# EAGLE board Central Board (EAGLE 8.4.1)
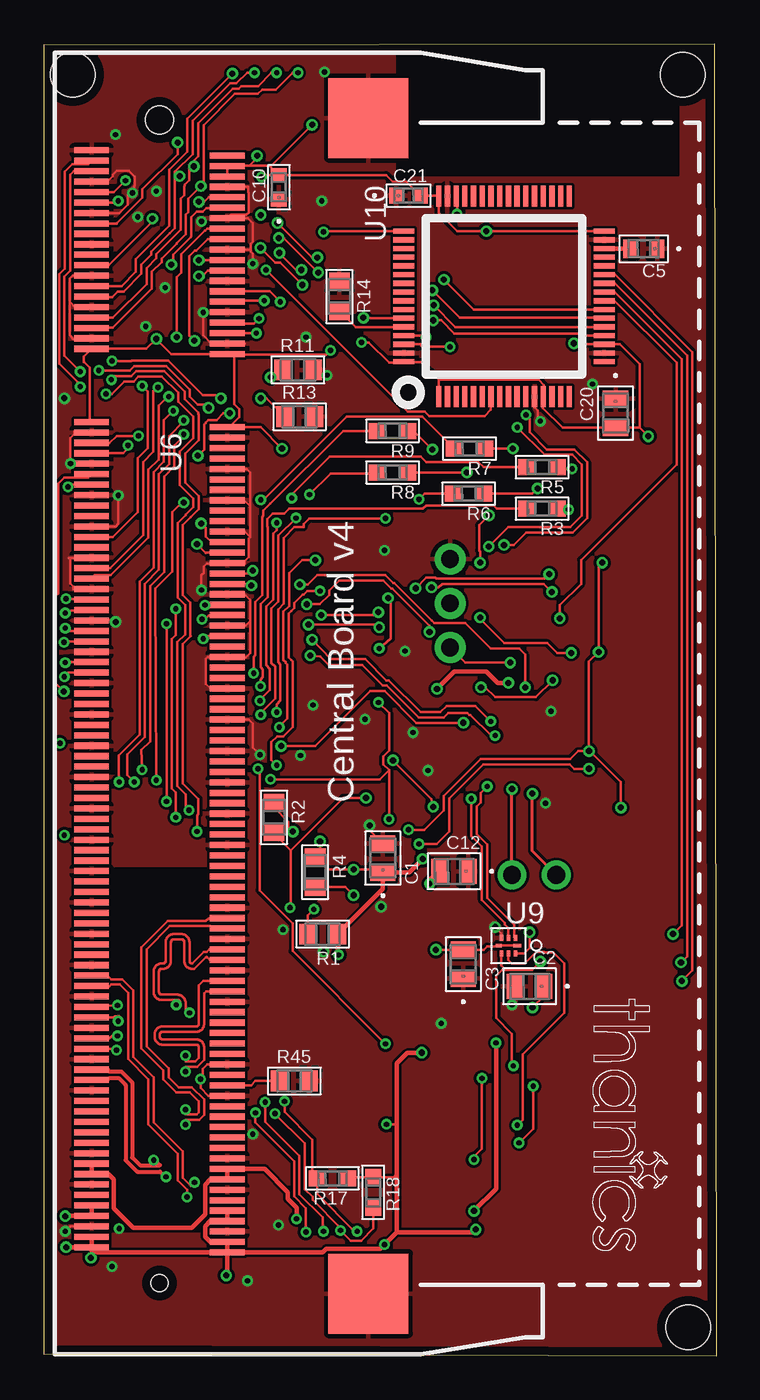
[diagram p3: board, top side]
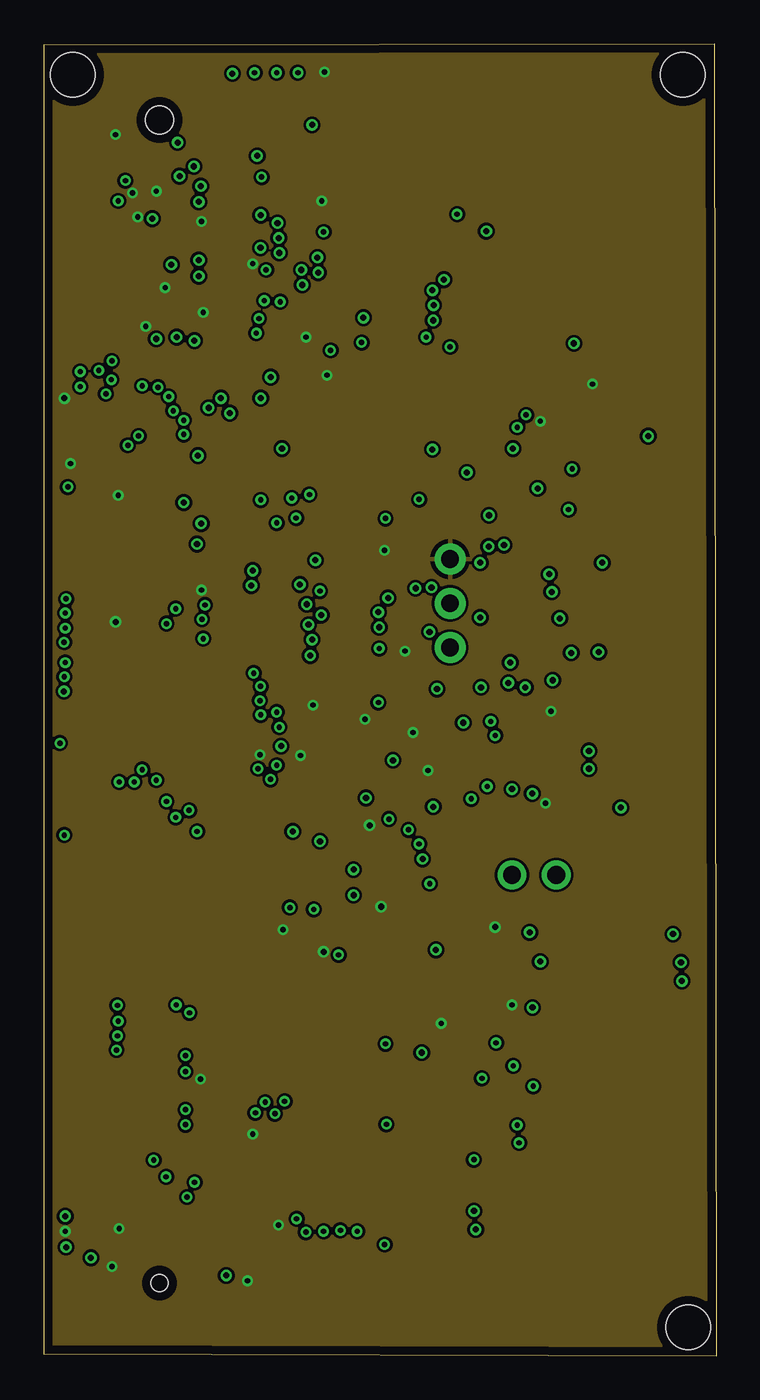
[diagram p4: board, inner layer Route2]
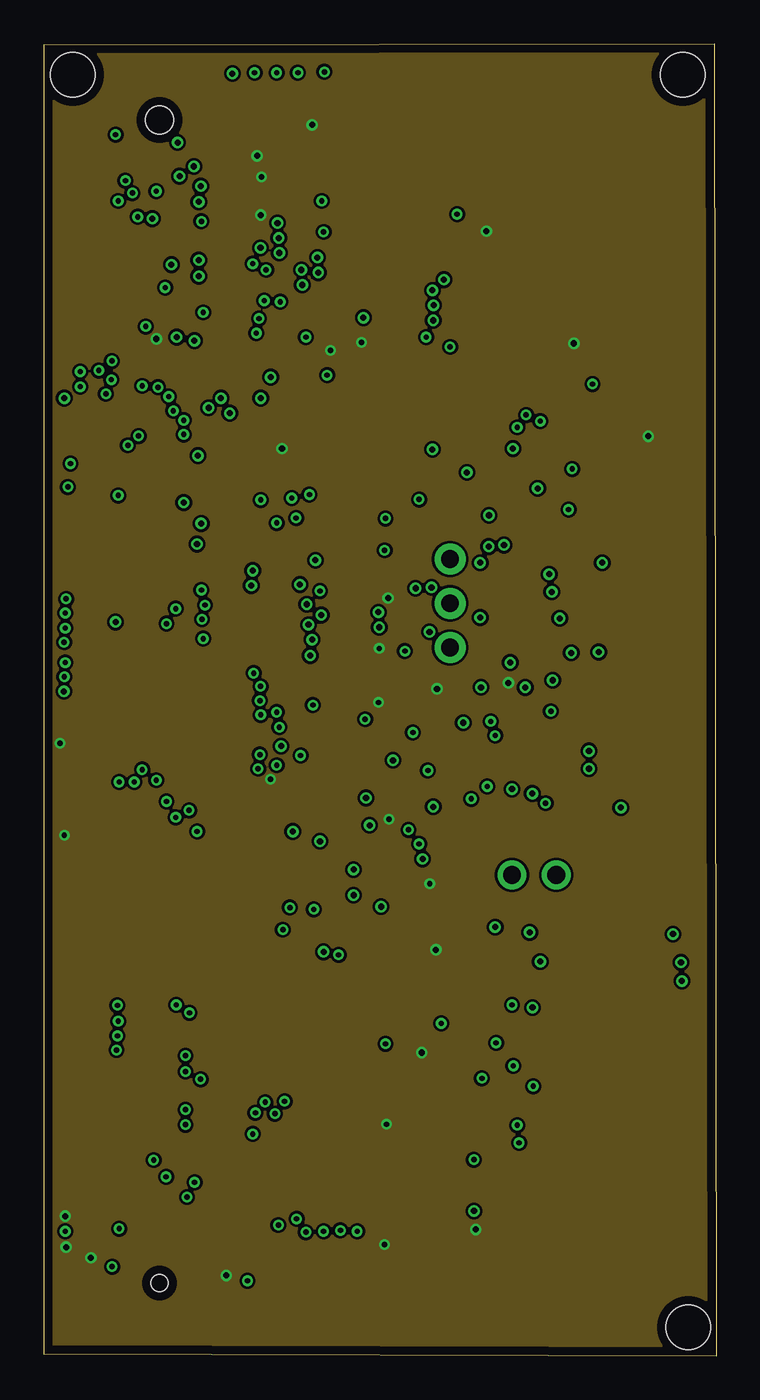
[diagram p5: board, inner layer Route15]
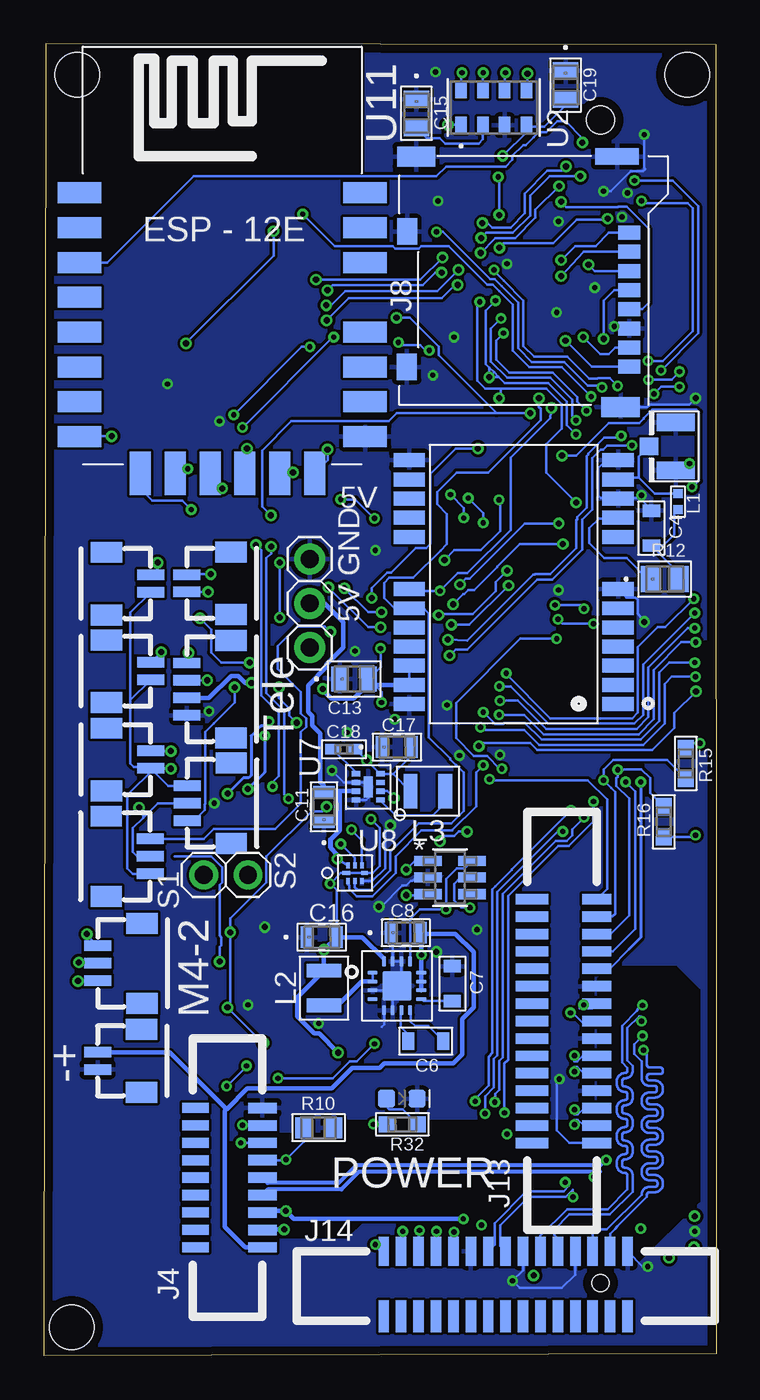
[diagram p6: board, bottom side, seen from below]

Size 38.63 x 75.39 mm. Coordinates in mm from the lower left corner, seen from the top.
Outline: 0,0.13 38.63,0 38.51,75.39 0.03,75.31 0,0.13
Copper layers (1*2*15*16): Top 0.035mm / dielectric 0.2mm / Route2 0.0175mm / dielectric 1.2mm / Route15 0.0175mm / dielectric 0.2mm / Bottom 0.035mm
Design rules "Elecrow_4-layer_PCB_eagle_rule *": minimum track width 6mil, minimum drill 12mil, track to track 6mil, track to pad 6mil, pad to pad 6mil, via to via 8mil, smd to smd 0mil, copper to edge 20mil, drill to drill 10mil, minimum pad ring 6mil, minimum via ring 6mil, stop-mask expansion 0mil, vias tented up to drill 100mil, thermal gap 10mil
Holes 2.54 mm at 37.01,1.65 1.68,73.58 36.7,73.58

## Footprints (pad centres in the part's own frame; a part is rotated, then mirrored left to right if it is on the bottom)
0805 = smd 0.965 x 1.448: 1 -0.826,0; 2 0.826,0
0603_CAPACITOR = smd 0.701 x 1.001: 1 -1.001,0; 2 1.001,0
0603-M = smd 0.813 x 1.067: 1 -0.775,0; 2 0.775,0
G-21 = smd 0.711 x 1.245: 1 -0.851,0; 2 0.851,0
G-188-M = smd 0.813 x 0.914: 1 -0.699,0; 2 0.699,0
YAG_CC0805 = smd 0.965 x 1.448: 1 -0.826,0; 2 0.826,0
CC0402N-M = smd 0.864 x 0.61: 1 -0.635,0; 2 0.635,0
LED-0603 = smd 1 x 1: A -0.877,0; C 0.877,0
JST_SH_2POS = smd 0.6 x 1.55: 1 -1.5,0; 2 -0.5,0 | smd 1.2 x 1.8: P$5 -2.8,2.525; P$6 0.8,2.525
JST_SH_4POS = smd 0.6 x 1.55: 1 -1.5,0; 2 -0.5,0; 3 0.5,0; 4 1.5,0 | smd 1.2 x 1.8: P$5 -2.8,2.525; P$6 2.8,2.525
9POS_FFC_CONNECTOR = smd 0.6 x 1.65: 1 -7.27,-2; 2 -6.27,-2; 3 -5.27,-2; 4 -4.27,-2; 5 -3.27,-2; 6 -2.27,-2; 7 -1.27,-2; 8 -0.27,-2; 9 0.73,-2 | smd 0.584 x 1.524: P$16 -7.27,1.852; P$17 -6.27,1.852; P$18 -5.27,1.852; P$19 -4.27,1.852; P$20 -3.27,1.852; P$21 -2.27,1.852; P$22 -1.27,1.852; P$23 -0.27,1.852; P$24 0.73,1.852
U.FL = smd 2.2 x 1: P$1 0,1.375; P$2 0,-1.375 | smd 1.05 x 1: P$3 1.525,0
MICROSD = smd 0.8 x 1.24: 1 -4.4,0; 2 -3.3,0; 3 -2.2,0; 4 -1.1,0; 5 0,0; 6 1.1,0; 7 2.2,0; 8 3.3,0 | smd 0.95 x 2.5: 9 -8.775,-0.7 | smd 1.15 x 2.2: 10 5.615,-0.5; 11 -8.775,-12.23 | smd 1.5 x 1.15: 12 -4.47,-12.755; 13 3.31,-12.775
JST_SH_3POS = smd 0.6 x 1.55: 1 -1.61,-0.08; 2 -0.61,-0.08; 3 0.39,-0.08 | smd 1.2 x 1.8: P$5 -2.91,2.445; P$6 1.69,2.445
15POS_FFC_CONNECTOR = smd 0.6 x 1.65: 1 -6,-2; 2 -5,-2; 3 -4,-2; 4 -3,-2; 5 -2,-2; 6 -1,-2; 7 0,-2; 8 1,-2; 9 2,-2; 10 3,-2; 11 4,-2; 12 5,-2; 13 6,-2; 14 7,-2; 15 8,-2 | smd 0.6 x 1.85: P$16 -6,1.725; P$17 -5,1.725; P$18 -4,1.725; P$19 -3,1.725; P$20 -2,1.725; P$21 -1,1.725; P$22 0,1.725; P$23 1,1.725; P$24 2,1.725; P$25 3,1.725; P$26 4,1.725; P$27 5,1.725; P$28 6,1.725; P$29 7,1.725; P$30 8,1.725
1X02 = drill 1.016 pad 1.651: 1 -1.27,0; 2 1.27,0
1X03 = drill 1.016 pad 1.778: 1 -2.54,0; 2 0,0; 3 2.54,0
0402_INDUCTOR = smd 0.525 x 0.55: P$1 -0.463,0; P$2 0.463,0
1008_INDUCTOR = smd 0.8 x 2: P$1 -1,0; P$2 1,0
RC0805N = smd 1.006 x 1.2: 1 -0.853,0; 2 0.853,0
RC0603N-M = smd 0.965 x 0.914: 1 -0.876,0; 2 0.876,0
STA_RNCP0805-M = smd 1.118 x 1.499: 1 -0.826,0; 2 0.826,0
LGA8-M = smd 0.94 x 0.66: 1 -1.003,1.875; 2 -1.003,0.625; 3 -1.003,-0.625; 4 -1.003,-1.875; 5 1.003,-1.875; 6 1.003,-0.625; 7 1.003,0.625; 8 1.003,1.875
MF06A-M = smd 1.575 x 0.584: 1 -1.27,0.953; 2 -1.27,0; 3 -1.27,-0.953; 4 1.27,-0.953; 5 1.27,0; 6 1.27,0.953
NEO-M8 = smd 1.8 x 0.8: 1 6.4,-7.4; 2 6.4,-6.3; 3 6.4,-5.2; 4 6.4,-4.1; 5 6.4,-3; 6 6.4,-1.9; 7 6.4,-0.8; 8 6.4,2.2; 9 6.4,3.3; 10 6.4,4.4; 11 6.4,5.5; 12 6.4,6.6; 13 -5.6,6.6; 14 -5.6,5.5; 15 -5.6,4.4; 16 -5.6,3.3; 17 -5.6,2.2; 18 -5.6,-0.8; 19 -5.6,-1.9; 20 -5.6,-3; 21 -5.6,-4.1; 22 -5.6,-5.2; 23 -5.6,-6.3; 24 -5.6,-7.4
VQFN16 = smd 0.6 x 0.24: 1 -1.4,0.75; 2 -1.4,0.25; 3 -1.4,-0.25; 4 -1.4,-0.75; 9 1.4,-0.75; 10 1.4,-0.25; 11 1.4,0.25; 12 1.4,0.75 | smd 0.24 x 0.6: 5 -0.75,-1.4; 6 -0.25,-1.4; 7 0.25,-1.4; 8 0.75,-1.4; 13 0.75,1.4; 14 0.25,1.4; 15 -0.25,1.4; 16 -0.75,1.4 | smd 1.68 x 1.68: 17 0,0
SO-DIMM = smd 0.35 x 2: 1 -26.4,-3.9; 2 -26.1,3.9; 3 -25.8,-3.9; 4 -25.5,3.9; 5 -25.2,-3.9; 6 -24.9,3.9; 7 -24.6,-3.9; 8 -24.3,3.9; 9 -24,-3.9; 10 -23.7,3.9; 11 -23.4,-3.9; 12 -23.1,3.9; 13 -22.8,-3.9; 14 -22.5,3.9; 15 -22.2,-3.9; 16 -21.9,3.9; 17 -21.6,-3.9; 18 -21.3,3.9; 19 -21,-3.9; 20 -20.7,3.9; 21 -20.4,-3.9; 22 -20.1,3.9; 23 -19.8,-3.9; 24 -19.5,3.9; 25 -19.2,-3.9; 26 -18.9,3.9; 27 -18.6,-3.9; 28 -18.3,3.9; 29 -18,-3.9; 30 -17.7,3.9; 31 -17.4,-3.9; 32 -17.1,3.9; 33 -16.8,-3.9; 34 -16.5,3.9; 35 -16.2,-3.9; 36 -15.9,3.9; 37 -15.6,-3.9; 38 -15.3,3.9; 39 -15,-3.9; 40 -14.7,3.9; 41 -10.8,-3.9; 42 -10.5,3.9; 43 -10.2,-3.9; 44 -9.9,3.9; 45 -9.6,-3.9; 46 -9.3,3.9; 47 -9,-3.9; 48 -8.7,3.9; 49 -8.4,-3.9; 50 -8.1,3.9; 51 -7.8,-3.9; 52 -7.5,3.9; 53 -7.2,-3.9; 54 -6.9,3.9; 55 -6.6,-3.9; 56 -6.3,3.9; 57 -6,-3.9; 58 -5.7,3.9; 59 -5.4,-3.9; 60 -5.1,3.9; 61 -4.8,-3.9; 62 -4.5,3.9; 63 -4.2,-3.9; 64 -3.9,3.9; 65 -3.6,-3.9; 66 -3.3,3.9; 67 -3,-3.9; 68 -2.7,3.9; 69 -2.4,-3.9; 70 -2.1,3.9; 71 -1.8,-3.9; 72 -1.5,3.9; 73 -1.2,-3.9; 74 -0.9,3.9; 75 -0.6,-3.9; 76 -0.3,3.9; 77 0,-3.9; 78 0.3,3.9; 79 0.6,-3.9; 80 0.9,3.9; 81 1.2,-3.9; 82 1.5,3.9; 83 1.8,-3.9; 84 2.1,3.9; 85 2.4,-3.9; 86 2.7,3.9; 87 3,-3.9; 88 3.3,3.9; 89 3.6,-3.9; 90 3.9,3.9; 91 4.2,-3.9; 92 4.5,3.9; 93 4.8,-3.9; 94 5.1,3.9; 95 5.4,-3.9; 96 5.7,3.9; 97 6,-3.9; 98 6.3,3.9; 99 6.6,-3.9; 100 6.9,3.9; 101 7.2,-3.9; 102 7.5,3.9; 103 7.8,-3.9; 104 8.1,3.9; 105 8.4,-3.9; 106 8.7,3.9; 107 9,-3.9; 108 9.3,3.9; 109 9.6,-3.9; 110 9.9,3.9; 111 10.2,-3.9; 112 10.5,3.9; 113 10.8,-3.9; 114 11.1,3.9; 115 11.4,-3.9; 116 11.7,3.9; 117 12,-3.9; 118 12.3,3.9; 119 12.6,-3.9; 120 12.9,3.9; 121 13.2,-3.9; 122 13.5,3.9; 123 13.8,-3.9; 124 14.1,3.9; 125 14.4,-3.9; 126 14.7,3.9; 127 15,-3.9; 128 15.3,3.9; 129 15.6,-3.9; 130 15.9,3.9; 131 16.2,-3.9; 132 16.5,3.9; 133 16.8,-3.9; 134 17.1,3.9; 135 17.4,-3.9; 136 17.7,3.9; 137 18,-3.9; 138 18.3,3.9; 139 18.6,-3.9; 140 18.9,3.9; 141 19.2,-3.9; 142 19.5,3.9; 143 19.8,-3.9; 144 20.1,3.9; 145 20.4,-3.9; 146 20.7,3.9; 147 21,-3.9; 148 21.3,3.9; 149 21.6,-3.9; 150 21.9,3.9; 151 22.2,-3.9; 152 22.5,3.9; 153 22.8,-3.9; 154 23.1,3.9; 155 23.4,-3.9; 156 23.7,3.9; 157 24,-3.9; 158 24.3,3.9; 159 24.6,-3.9; 160 24.9,3.9; 161 25.2,-3.9; 162 25.5,3.9; 163 25.8,-3.9; 164 26.1,3.9; 165 26.4,-3.9; 166 26.7,3.9; 167 27,-3.9; 168 27.3,3.9; 169 27.6,-3.9; 170 27.9,3.9; 171 28.2,-3.9; 172 28.5,3.9; 173 28.8,-3.9; 174 29.1,3.9; 175 29.4,-3.9; 176 29.7,3.9; 177 30,-3.9; 178 30.3,3.9; 179 30.6,-3.9; 180 30.9,3.9; 181 31.2,-3.9; 182 31.5,3.9; 183 31.8,-3.9; 184 32.1,3.9; 185 32.4,-3.9; 186 32.7,3.9; 187 33,-3.9; 188 33.3,3.9; 189 33.6,-3.9; 190 33.9,3.9; 191 34.2,-3.9; 192 34.5,3.9; 193 34.8,-3.9; 194 35.1,3.9; 195 35.4,-3.9; 196 35.7,3.9; 197 36,-3.9; 198 36.3,3.9; 199 36.6,-3.9; 200 36.9,3.9 | smd 4.6 x 4.6: G1 -28.254,12; G2 39.27,12 | hole 1.6: -28.15,0 | hole 0.965: 38.65,0
MLF(ML)_8PIN = smd 0.5 x 0.3: 1 -0.7,0.75; 2 -0.7,0.25; 3 -0.7,-0.25; 4 -0.7,-0.75; 5 0.7,-0.75; 6 0.7,-0.25; 7 0.7,0.25; 8 0.7,0.75 | smd 0.5 x 1.2: EP 0,0
8-UMLP = smd 0.45 x 0.22: 1 -0.5,0 | smd 0.22 x 0.35: 2 -0.4,-0.45; 3 0,-0.45; 4 0.4,-0.45; 6 0.4,0.45; 7 0,0.45; 8 -0.4,0.45 | smd 0.35 x 0.22: 5 0.55,0
LQFP64 = smd 1.2 x 0.3: 1 -5.75,3.75; 2 -5.75,3.25; 3 -5.75,2.75; 4 -5.75,2.25; 5 -5.75,1.75; 6 -5.75,1.25; 7 -5.75,0.75; 8 -5.75,0.25; 9 -5.75,-0.25; 10 -5.75,-0.75; 11 -5.75,-1.25; 12 -5.75,-1.75; 13 -5.75,-2.25; 14 -5.75,-2.75; 15 -5.75,-3.25; 16 -5.75,-3.75; 33 5.75,-3.75; 34 5.75,-3.25; 35 5.75,-2.75; 36 5.75,-2.25; 37 5.75,-1.75; 38 5.75,-1.25; 39 5.75,-0.75; 40 5.75,-0.25; 41 5.75,0.25; 42 5.75,0.75; 43 5.75,1.25; 44 5.75,1.75; 45 5.75,2.25; 46 5.75,2.75; 47 5.75,3.25; 48 5.75,3.75 | smd 0.3 x 1.2: 17 -3.75,-5.75; 18 -3.25,-5.75; 19 -2.75,-5.75; 20 -2.25,-5.75; 21 -1.75,-5.75; 22 -1.25,-5.75; 23 -0.75,-5.75; 24 -0.25,-5.75; 25 0.25,-5.75; 26 0.75,-5.75; 27 1.25,-5.75; 28 1.75,-5.75; 29 2.25,-5.75; 30 2.75,-5.75; 31 3.25,-5.75; 32 3.75,-5.75; 49 3.75,5.75; 50 3.25,5.75; 51 2.75,5.75; 52 2.25,5.75; 53 1.75,5.75; 54 1.25,5.75; 55 0.75,5.75; 56 0.25,5.75; 57 -0.25,5.75; 58 -0.75,5.75; 59 -1.25,5.75; 60 -1.75,5.75; 61 -2.25,5.75; 62 -2.75,5.75; 63 -3.25,5.75; 64 -3.75,5.75
ESP12E-SMD = smd 2.5 x 1.2: ADC -8.3,3.8; CH_PD -8.3,1.8; GND 8.1,-8.2; GPIO0 8.1,-2.2; GPIO2 8.1,-4.2; GPIO5 8.1,1.8; GPIO12 -8.3,-4.2; GPIO13 -8.3,-6.2; GPIO14 -8.3,-2.2; GPIO15 8.1,-6.2; GPIO16 -8.3,-0.2; RESET -8.3,5.8; RXD0 8.1,3.8; TXD0 8.1,5.8; VCC -8.3,-8.2 | smd 1.2 x 2.5: CS0 -4.8,-10.3; GPIO9 -0.8,-10.3; GPIO10 1.2,-10.3; MISO -2.8,-10.3; MOSI 3.2,-10.3; SCLK 5.2,-10.3

## Placement (x,y rotation side)
C1  0.1uF  [0805]  19.48,28.6 90 top
C2  0.1uF  [0805]  27.91,21.23 180 top
C3  0.1uF  [0805]  24.1,22.5 90 top
C4  10nF  [0603_CAPACITOR]  3.73,47.55 270 bottom
C5  4.7uF  [0603-M]  34.47,63.6 180 top
C6  10nF  [0603_CAPACITOR]  16.69,18.08 180 bottom
C7  10nF  [0603_CAPACITOR]  15.16,21.39 270 bottom
C8  10uF  [G-21]  17.83,24.31 0 bottom
C10  2.2uF  [G-188-M]  13.51,67.13 90 top
C11  10uF  [G-21]  22.53,31.55 90 bottom
C12  0.1uF  [0805]  23.57,27.84 180 top
C13  0.1uF  [0805]  20.8,38.89 0 bottom
C15  1uF  [YAG_CC0805]  17.22,71.37 270 bottom
C16  22uF  [G-21]  22.66,24.05 0 bottom
C17  10uF  [G-21]  18.34,34.98 0 bottom
C18  560pF  [CC0402N-M]  21.39,34.85 0 bottom
C19  1uF  [YAG_CC0805]  8.66,73 270 bottom
C20  0.1uF  [0805]  32.84,54.15 270 top
C21  2.2uF  [G-188-M]  20.95,66.65 0 top
D1  GREEN  [LED-0603]  18.06,14.78 0 bottom
J1  [JST_SH_2POS]  32.49,45.36 90 bottom
J2  [JST_SH_2POS]  32.49,40.34 90 bottom
J3  [JST_SH_4POS]  30.4,38.3 270 bottom
J4  [9POS_FFC_CONNECTOR]  28.07,13.51 90 bottom
J5  U.FL  [U.FL]  2.34,52.25 180 bottom
J6  [JST_SH_2POS]  35.53,15.95 270 bottom
J7  [JST_SH_2POS]  32.49,35.26 90 bottom
J8  MICROSD  [MICROSD]  5,60.12 270 bottom
J9  [JST_SH_2POS]  30.4,43.38 270 bottom
J10  [JST_SH_3POS]  30.3,31.14 270 bottom
J11  [JST_SH_3POS]  32.59,29.31 90 bottom
J12  [JST_SH_3POS]  35.43,21.95 270 bottom
J13  [15POS_FFC_CONNECTOR]  8.86,18.24 90 bottom
J14  [15POS_FFC_CONNECTOR]  11.1,4.01 180 bottom
JP1  [1X02]  28.17,27.64 0 bottom
JP2  [1X03]  23.34,43.23 90 bottom
L1  27 nH  [0402_INDUCTOR]  2.21,49.07 270 bottom
L2  470nH  [1008_INDUCTOR]  22.53,21.13 90 bottom
L3  470nH  [1008_INDUCTOR]  16.56,32.44 180 bottom
R1  10k  [RC0805N]  16.03,24.23 180 top
R2  10k  [RC0805N]  13.23,30.94 270 top
R3  20R  [RC0603N-M]  28.63,48.67 180 top
R4  10k  [RC0805N]  15.6,27.79 270 top
R5  20R  [RC0603N-M]  28.63,51.05 180 top
R6  20R  [RC0603N-M]  24.41,49.53 180 top
R7  20R  [RC0603N-M]  24.46,52.12 180 top
R8  20R  [RC0603N-M]  20.04,50.75 180 top
R9  20R  [RC0603N-M]  20.04,53.14 180 top
R10  10k  [RC0805N]  22.83,13.11 0 bottom
R11  10k  [RC0805N]  14.61,56.64 0 top
R12  10  [STA_RNCP0805-M]  2.97,44.63 0 bottom
R13  10k  [RC0805N]  14.71,53.95 0 top
R14  10k  [RC0805N]  16.99,60.86 270 top
R15  1k  [RC0603N-M]  1.75,34.04 270 bottom
R16  1k  [RC0603N-M]  3.02,30.68 90 bottom
R17  1k  [RC0603N-M]  16.59,10.21 180 top
R18  1k  [RC0603N-M]  18.92,9.4 270 top
R32  20R  [RC0603N-M]  18.03,13.31 180 bottom
R45  10k  [RC0805N]  14.4,15.8 0 top
U2  [LGA8-M]  12.78,71.7 90 bottom
U3  LM3880MF-1AA/NOPBMF06A-M  [MF06A-M]  15.29,27.48 0 bottom
U4  NEO-M8  [NEO-M8]  12.04,44.85 0 bottom
U5  TPS6209  [VQFN16]  18.34,21.26 0 bottom
U6  [SO-DIMM]  6.65,42.85 270 top
U7  MIC23050  [MLF(ML)_8PIN]  19.99,32.69 180 bottom
U8  [8-UMLP]  20.75,27.74 0 bottom
U9  [8-UMLP]  26.7,23.57 180 top
U10  [LQFP64]  26.44,60.86 90 top
U11  [ESP12E-SMD]  28.27,61.01 0 bottom

## Tracks (layer width: path | path; a pad name or v marks a point on that pad's centre or on a via)
1.8V  (via drill 0.3, 0.35)
  Top 0.152: 10.52,10.72 U6.184 | C2.1 28.74,20.68 v28.07,20.02 | v22.38,31.55 22.28,32 v20.06,34.22 | U9.8 27.61,23.12 27.91,23.43 v27.91,24.33
  Top 0.254: v25.98,17.98 25.98,9.6 v24.71,8.33 | U6.183 U6.185 3.73,10.45 4.03,10.14 4.03,8.49 5.16,7.37 8.51,7.37 9.27,8.13 9.27,9.84 9.59,10.15 U6.186 U6.184 12.69,10.75 14.03,9.41 14.03,9.02 14.53,8.52 v14.53,7.87
  Bottom 0.152: L3.P$2 17.58,32.44 18.57,33.43 | 18.57,33.43 19.28,33.43 U7.4 v20.06,34.22 20.7,34.85 C18.2 | 18.57,33.43 17.49,34.51 C17.2 17.46,35 | v25.98,17.98 26.04,17.98 v28.07,20.02 27.91,20.17 v27.91,24.33 27.91,25.13 25.84,27.2 25.84,28.68 23.25,31.28 22.64,31.28 v22.38,31.55
  Bottom 0.254: J4.3 25.98,8.33 v24.71,8.33 24.26,7.87 v14.53,7.87
+3V3  (via drill 0.3, 0.35)
  Top 0.152: 2.75,6.76 U6.197 | v12.27,68.94 12.27,68.83 11.81,68.38 | 11.81,68.38 10.58,68.38 U6.4 U6.6 | 11.81,68.38 12.97,68.38 | 12.97,68.38 C10.2 | 12.97,68.38 13.08,68.38 v15.42,70.71 | v19.28,40.64 19.94,41.2 19.94,43.38 v19.79,43.54 | v22.17,27.13 22.17,27.47 C12.2 | C10.2 12.64,67.83 v12.52,67.72 | v19.23,37.54 19.84,36.93 19.84,34.77 19.51,34.45 19.51,33.98 19.84,33.66 | U9.1 U9.5 26.1,23.53 26.09,23.53 26.09,23.52 25.48,23.52 25.29,23.33 C3.2 v22.53,23.33 | 19.84,33.66 v19.84,30.84 | 34.23,53.33 C20.2 | 34.23,53.33 v34.72,52.83 | C20.2 32.19,53.33 | 34.23,53.33 34.23,56.99 33.1,58.12 33.09,58.11 32.33,58.11 | 32.33,58.11 U10.19 30.51,58.11 v30.45,58.17 | U10.32 v25.42,64.61 23.76,64.61 22.68,65.68 22.68,66.6 U10.48 22.65,66.65 C21.2 20.84,67.46 20.04,67.46 19.67,67.83 C10.2 | C20.2 29.81,53.33 28.68,54.46 28.68,55.09 U10.13 28.73,55.14 28.73,55.78 28.42,56.08 22.68,56.08 | v13.03,33.12 19.3,33.12 19.84,33.66 | 20.3,13.31 20.3,10.47 20.1,10.27 R18.1 17.53,10.27 R17.1 | U6.41 2.64,53.76 2.64,56.76 2.33,57.07 2.31,57.07 2.31,57.41 U6.39 5.91,57.85 v6.48,58.42 7.35,57.55 U6.40 10.6,57.51 10.95,57.51 | U10.1 22.68,55.12 22.68,56.08 | 22.68,56.08 21.67,57.1 U10.64 20.63,57.05 19.84,57.05 18.67,58.22 v18.26,58.22 | 32.29,58.06 32.33,58.11 | v16.48,57.76 16.23,57.51 10.95,57.51 | v19.69,13.31 20.3,13.31 | 20.3,13.31 20.3,16.87 20.8,17.37 20.85,17.37 | 10.95,57.51 10.95,54.68 11.25,54.38 11.25,53.92 10.67,53.35 U6.42 12.46,53.35 v13.69,52.12
  Top 0.254: U6.199 2.75,6.76 | U6.191 U6.193 1.25,8.05 v1.25,8.03 | U6.200 U6.198 9.59,6.55 9.27,6.86 9.27,7.44 9.59,7.75 U6.194 U6.192 | 20.3,7.11 24.66,7.11 v24.82,7.26 | 20.3,7.11 v19.58,6.4 19.34,6.16 16.24,6.16 16.03,5.95 U6.200 | 20.3,7.11 20.3,10.47 20.3,16.82 20.85,17.37 20.9,17.42 v21.72,17.42 | v22.59,38.32 23.59,39.32 25.42,39.32 26.09,38.66 v26.69,38.66 | U6.199 v1.3,6.25 | U6.199 2.75,5.64 v2.72,5.64 | U6.200 10.55,4.62 v10.49,4.62 | U6.200 3.05,5.95 U6.199
  Bottom 0.152: 19.09,22.82 U5.16 | C19.2 8.66,71.83 9.88,70.61 10.81,70.61 U2.4 10.9,70.3 v12.27,68.94 | v15.42,70.71 14.66,70.71 U2.1 | v6.48,58.42 6.48,60.6 5.87,61.21 J8.4 | C13.2 19.64,38.55 U4.23 U4.22 | v19.28,40.64 19.28,39.59 19.92,38.94 C13.2 | C16.2 21.81,26.76 v22.17,27.13 21.56,27.74 U8.1 U8.5 19.74,27.74 19.33,28.14 19.33,30.33 v19.84,30.84 | v19.23,37.54 19.23,38.14 C13.2 | v12.47,65.53 12.47,67.67 v12.52,67.72 | v34.72,52.83 36.55,52.83 U11.VCC | J13.15 6.27,26.83 6.27,31.95 7.39,33.07 12.98,33.07 v13.03,33.12 | v16.48,57.76 16.69,57.76 16.99,58.06 18.11,58.06 v18.26,58.22 | R32.2 v19.69,13.31 | v19.79,43.54 19.79,44.12 18.9,45.01 18.67,45.01 17.26,46.42 16.64,46.42 16.43,46.63 16.43,50.65 14.96,52.12 v13.69,52.12 | v30.45,58.17 25.42,63.2 v25.42,64.61 | R15.1 1.46,35.2 v0.94,35.2 | R16.1 1.31,29.81 v1.19,29.92
  Bottom 0.254: 19.09,22.82 20.32,24.05 C16.2 v22.53,23.33 L2.P$2 24.06,20.6 24.06,19.5 23.08,18.52 22.81,18.52 v21.72,17.42 | v19.58,6.4 19.2,6.01 J14.15 | v24.82,7.26 26.05,7.26 J4.2 | U4.23 19.52,38.55 19.92,38.94 | J3.3 29.13,37.8 27.86,39.07 27.46,39.07 27.05,38.66 v26.69,38.66 | C13.2 19.98,38.62 20.83,37.77 22.11,37.77 22.59,38.25 v22.59,38.32
  pour Route15: 0.03,0.2 38.53,0.2 38.53,75.39 0.03,75.39
+5V  (via drill 0.3, 0.35)
  Top 0.152: C1.1 19.32,27.94 v17.8,27.94 16.3,27.94 R4.1 15.88,28.92 v15.88,29.57 | v14.31,30.12 14.06,30.38 14.06,30.68 13.23,31.51 R2.1
  Top 0.254: v21.77,28.55 20.99,27.78 C1.1 19.48,26.83 R1.1 16.88,23.1 v16.94,23.04
  Bottom 0.152: 21.46,32.44 U7.7 | 21.46,32.44 21.56,32.44 21.67,32.44 | 22.38,32.44 22.49,32.44 C11.2 | U3.1 17.31,28.44 v17.8,27.94 | U8.8 | U8.8 v21.77,28.55 21.77,28.75 22.23,29.21 22.23,29.7 21.68,30.25 21.68,32.22 21.46,32.44 | v14.31,30.12 14.78,30.12 15.04,29.87 15.57,29.87 v15.88,29.57 | 16.94,22.91 v16.94,23.04
  Bottom 0.254: U5.10 U5.11 U5.12 16.94,22.91 | v16.94,23.04 16.94,24.27 C8.2 16.93,24.26 14.99,24.26 13.95,23.22 13.95,20.02 14.61,19.36 14.61,17.32 15.11,16.82 19.08,16.82 19.33,16.56 20.9,16.56 22.1,15.37 26.92,15.37 28.12,14.17 | J4.1 27.05,6.24 28.22,7.42 28.22,14.07 28.12,14.17 | C11.2 22.53,32.77 22.73,32.97 22.73,35.76 23.19,36.22 23.19,36.75 23.44,37 23.44,38.51 22.39,39.56 22.39,39.73 21.41,40.71 21.41,42.16 22.48,43.23 JP2.2 | 22.38,32.44 21.67,32.44 U7.7 | v21.77,28.55 21.77,28.79 22.15,29.17 22.15,29.66 21.63,30.18 21.63,32.38 21.56,32.44 | J6.1 31.4,17.45 28.12,14.17
C0_C_N  (via drill 0.3)
  Top 0.152: U6.144 9.53,22.75 9.4,22.89 | 9.4,22.89 9.37,22.91 | v8.38,19.71 8.15,19.76 8.15,20.3 arc90 7.7,20.76 6.78,20.76 arc-90 6.63,20.91 6.63,22.09 arc-90 6.78,22.24 6.86,22.24 arc90 7.32,22.7 7.32,23.77 arc-90 7.47,23.93 7.93,23.93 arc-90 8.08,23.77 8.08,22.7 arc90 8.54,22.24 8.66,22.24 9.31,22.89 9.4,22.89
  Bottom 0.152: v8.38,19.71 8.15,19.76 8.15,19.61 7.64,19.1 7.51,19.24 J13.8
C0_C_P  (via drill 0.3)
  Top 0.152: U6.142 9.51,23.35 9.37,23.22 9.21,23.22 8.54,22.54 arc-90 8.38,22.7 8.38,23.77 arc90 7.93,24.23 7.47,24.23 arc90 7.01,23.77 7.01,22.7 arc-90 6.86,22.54 6.78,22.54 arc90 6.32,22.09 6.32,20.91 arc90 6.78,20.45 7.7,20.45 arc-90 7.85,20.3 7.85,20.17 v7.62,20.17
  Bottom 0.152: v7.62,20.17 7.85,20.17 7.85,19.96 7.14,19.96 J13.9
C0_D0_N  (via drill 0.3)
  Top 0.152: v8.15,13.28 8.15,13.56 8.93,13.56 9.22,13.86 9.22,14.74 8.52,15.44 7.76,15.44 7.19,16.01 7.19,16.52 5.92,17.79 5.92,23.36 7.25,24.69 9.58,24.69 9.73,24.54 10.54,24.54 U6.138
  Bottom 0.152: J13.2 7.62,13.24 7.95,13.56 8.15,13.56 v8.15,13.28
C0_D0_P  (via drill 0.3)
  Top 0.152: v8.15,14.15 8.15,13.87 8.8,13.87 8.91,13.98 8.91,14.62 8.39,15.14 7.63,15.14 6.88,15.89 6.88,16.4 5.61,17.67 5.61,23.48 7.12,24.99 9.32,24.99 9.47,25.15 U6.136
  Bottom 0.152: J13.3 7.58,14.24 7.95,13.87 8.15,13.87 v8.15,14.15
C0_D1_N  (via drill 0.3)
  Top 0.152: v8.15,16.33 8.15,16.61 8.83,16.61 9.22,17.01 9.22,17.73 arc90 8.76,18.19 6.83,18.19 arc-90 6.68,18.34 6.68,18.47 arc-90 6.83,18.62 8.76,18.62 arc90 9.22,19.08 9.22,20.83 9.34,20.95 U6.150
  Bottom 0.152: J13.5 7.63,16.24 8,16.61 8.15,16.61 v8.15,16.33
C0_D1_P  (via drill 0.3)
  Top 0.152: v8.15,17.25 8.15,16.92 8.7,16.92 8.91,17.13 8.91,17.73 arc90 8.76,17.88 6.83,17.88 arc-90 6.38,18.34 6.38,18.47 arc-90 6.83,18.93 8.76,18.93 arc90 8.91,19.08 8.91,21.29 9.18,21.55 U6.148
  Bottom 0.152: J13.6 7.68,17.24 8,16.92 8.15,16.92 v8.15,17.25
C0_IO0  (via drill 0.3)
  Top 0.152: v12.22,58.75 U6.36 | U6.36 | v7.45,54.3 6.91,53.75 6.91,51.36 6.32,50.78 6.32,45.29 5.51,44.47 5.51,35.69 4.31,34.48 4.31,33.01 v4.34,32.97
  Bottom 0.152: J13.11 6.14,22.24 5,23.37 | v12.22,58.75 12.64,58.33 12.64,57.24 11.89,56.49 9.4,56.49 7.98,55.07 7.98,54.82 v7.45,54.3
  Bottom 0.178: v4.34,32.97 4.34,24.03 5,23.37
C0_IO1  (via drill 0.3)
  Top 0.152: v12.37,59.59 12.07,59.28 10.62,59.28 U6.34 | v8.05,53.75 8.05,53.69 7.21,52.85 7.21,51.23 6.63,50.65 6.63,45.16 5.82,44.35 5.82,35.56 4.8,34.54 4.8,33.38 v5.21,32.97
  Bottom 0.152: J13.12 5.95,23.24 4.66,24.52 4.66,32.42 v5.21,32.97 | v12.37,59.59 12.94,59.02 12.94,57.11 12.02,56.19 9.53,56.19 8.28,54.94 8.28,53.98 v8.05,53.75
C1_C_N  (via drill 0.3)
  Top 0.152: U6.149 2.77,21.23 3.79,21.23 3.89,21.34 4.38,21.34 4.85,20.87 4.85,17.06 6.02,15.89 6.02,13.3 7.7,11.62 7.7,10.1 8.25,9.54 v8.24,9.13
  Bottom 0.152: v8.24,9.13 8.25,9.54 8.65,9.14 10.78,9.14 12.42,7.51 12.42,6.33 J14.8
C1_C_P  (via drill 0.3)
  Top 0.152: U6.147 2.8,21.9 3.63,21.9 3.89,21.64 4.51,21.64 5.16,20.99 5.16,17.18 6.32,16.01 6.32,13.42 8,11.75 8,10.22 8.46,9.76 v8.68,9.97
  Bottom 0.152: v8.68,9.97 8.46,9.76 8.77,9.45 10.91,9.45 12.73,7.63 12.73,6.39 J14.9
C1_D0_N  (via drill 0.3)
  Top 0.152: v4.19,17.58 4.09,17.58 3.99,17.68 3.96,17.65 U6.161
  Bottom 0.152: v4.19,17.58 3.99,17.37 3.99,16.72 arc-90 3.84,16.57 3.23,16.57 arc90 3.07,16.42 3.07,16.35 arc90 3.23,16.2 3.84,16.2 arc-90 3.99,16.04 3.99,15.98 arc-90 3.84,15.82 3.53,15.82 arc90 3.07,15.37 3.07,15.3 arc90 3.53,14.84 3.84,14.84 arc-90 3.99,14.69 3.99,14.62 arc-90 3.84,14.47 3.53,14.47 arc90 3.07,14.01 3.07,13.94 arc90 3.53,13.48 3.84,13.48 arc-90 3.99,13.33 3.99,13.26 arc-90 3.84,13.11 3.53,13.11 arc90 3.07,12.65 3.07,12.58 arc90 3.53,12.12 3.84,12.12 arc-90 3.99,11.97 3.99,11.9 arc-90 3.84,11.75 3.53,11.75 arc90 3.07,11.29 3.07,11.22 arc90 3.53,10.77 3.84,10.77 arc-90 3.99,10.62 3.99,10.55 arc-90 3.84,10.39 3.53,10.39 arc90 3.07,9.94 3.07,9.87 arc90 3.53,9.41 3.84,9.41 arc-90 3.99,9.26 3.99,9.13 5.68,7.44 5.81,7.31 6.1,7.02 J14.2
C1_D0_P  (via drill 0.3)
  Top 0.152: v4.24,18.39 3.94,18.39 3.79,18.24 3.77,18.25 U6.159
  Bottom 0.152: v4.24,18.39 4.72,17.91 4.72,17.36 4.29,16.92 4.29,15.98 arc-90 3.84,15.52 3.56,15.52 arc90 3.41,15.37 3.41,15.3 arc90 3.56,15.14 3.84,15.14 arc-90 4.29,14.69 4.29,14.62 arc-90 3.84,14.16 3.53,14.16 arc90 3.38,14.01 3.38,13.94 arc90 3.53,13.79 3.84,13.79 arc-90 4.29,13.33 4.29,13.26 arc-90 3.84,12.8 3.53,12.8 arc90 3.38,12.65 3.38,12.58 arc90 3.53,12.43 3.84,12.43 arc-90 4.29,11.97 4.29,11.9 arc-90 3.84,11.45 3.53,11.45 arc90 3.38,11.29 3.38,11.22 arc90 3.53,11.07 3.84,11.07 arc-90 4.29,10.62 4.29,10.55 arc-90 3.84,10.09 3.53,10.09 arc90 3.38,9.94 3.38,9.87 arc90 3.53,9.72 3.84,9.72 arc-90 4.29,9.26 6.29,7.26 6.88,7.26 7.1,7.05 J14.3
C1_D1_N  (via drill 0.3)
  Top 0.152: v4.29,19.23 4.34,19.51 4.09,19.51 4.03,19.45 U6.155
  Bottom 0.152: v4.29,19.23 4.34,19.51 4.43,19.51 5.11,18.83 5.11,16.98 4.8,16.68 4.8,16.4 arc90 5.26,15.95 arc-90 5.41,15.79 5.41,15.63 arc-90 5.26,15.47 arc90 4.8,15.02 4.8,14.85 arc90 5.26,14.39 arc-90 5.41,14.24 5.41,14.08 arc-90 5.26,13.92 arc90 4.8,13.47 4.8,13.3 arc90 5.26,12.84 arc-90 5.41,12.69 5.41,12.52 arc-90 5.26,12.37 arc90 4.8,11.91 4.8,11.75 arc90 5.26,11.29 arc-90 5.41,11.14 5.41,10.97 arc-90 5.26,10.82 arc90 4.8,10.36 4.8,9.44 6.11,8.13 8.45,8.13 9.32,7.26 9.32,6.95 9.02,6.66 9.02,6.1 J14.5
C1_D1_P  (via drill 0.3)
  Top 0.152: v4.24,20.14 U6.153
  Bottom 0.152: v4.24,20.14 4.5,19.96 4.56,19.81 5.41,18.96 5.41,16.85 5.11,16.55 5.11,16.4 arc90 5.26,16.25 arc-90 5.71,15.79 5.71,15.63 arc-90 5.26,15.17 arc90 5.11,15.02 5.11,14.85 arc90 5.26,14.7 arc-90 5.71,14.24 5.71,14.08 arc-90 5.26,13.62 arc90 5.11,13.47 5.11,13.3 arc90 5.26,13.15 arc-90 5.71,12.69 5.71,12.52 arc-90 5.26,12.07 arc90 5.11,11.91 5.11,11.75 arc90 5.26,11.6 arc-90 5.71,11.14 5.71,10.97 arc-90 5.26,10.52 arc90 5.11,10.36 5.11,9.56 6.23,8.43 8.57,8.43 10.1,6.91 J14.6
C1_IO0  (via drill 0.3)
  Top 0.152: v7.06,31.85 v7.06,42.06 | v9.1,42.32 9.27,42.32 9.47,42.52 10.52,42.52 U6.78 | v12.17,13.97 12.17,13.41 14.39,11.19 14.39,9.17 15.06,8.49 v15.06,7.11
  Bottom 0.152: v7.06,31.85 7.06,30.7 8.47,29.29 9.09,29.29 11.96,26.42 11.96,17.02 12.17,16.82 v12.17,13.97 | v7.06,42.06 8.85,42.06 v9.1,42.32 | v15.06,7.11 15.1,7.07 J14.11
C1_IO1  (via drill 0.3)
  Top 0.152: v7.59,30.94 7.59,32.36 7.37,32.59 7.37,41.17 7.59,41.4 v7.59,42.93 | v9.27,43.13 9.29,43.15 U6.76 | v12.73,14.58 12.73,13.46 14.69,11.49 14.69,9.29 16.03,7.96 16.03,7.21 v16.08,7.16
  Bottom 0.152: v7.59,30.94 8.29,30.25 8.29,29.91 8.6,29.59 9.22,29.59 12.27,26.54 12.27,17.14 12.47,16.94 12.47,15.29 12.7,15.06 12.7,14.76 v12.73,14.58 | v7.59,42.93 7.8,43.13 v9.27,43.13 | v16.08,7.16 16.1,7.14 J14.12
GND  (via drill 0.3, 0.35)
  Top 0.152: 11.54,58.15 U6.38 9.64,58.15 9.17,58.62 v9.17,59.94 | v18.72,30.48 18.72,30.19 C1.2 | U9.4 26.3,24.28 v25.93,24.64 | U6.79 4.05,42.25 v4.14,42.16 | U6.25 1.67,62.05 1.5,61.87 1.5,60.55 | 1.5,60.55 1.85,60.2 2.7,60.2 U6.31 | 1.5,60.55 1.5,58.62 1.7,58.42 2.73,58.42 U6.37 | 11.52,43.75 U6.74 10.62,43.69 11.61,43.69 11.86,43.43 11.86,42.22 | 11.86,47.04 11.56,47.35 U6.62 | 11.86,47.04 11.86,48.82 | 11.86,48.82 11.51,49.17 10.58,49.17 U6.56 | 2.71,51.21 U6.49 1.83,51.26 1.53,51.56 1.53,52.72 1.75,52.95 1.75,53.09 1.79,53.05 U6.43 | U6.170 9.46,14.95 9.02,15.39 v9.02,15.9 9.14,16.02 9.14,16.49 9.39,16.75 U6.164 | 11.86,42.22 11.61,41.96 10.57,41.96 U6.80 | 11.86,42.22 11.86,40.39 11.61,40.13 10.57,40.13 U6.86 9.44,40.15 9.33,40.04 9.33,38.6 9.58,38.35 U6.92 | U6.98 11.79,36.55 12.01,36.32 12.01,34.95 v12.42,34.54 | 11.86,48.82 11.86,50.75 11.66,50.95 U6.50 | U6.7 3.65,67.45 3.98,67.78 3.98,67.86 4.19,68.07 4.9,68.07 5.25,67.73 5.25,67.25 v5.11,66.8 4.83,66.68 4.83,66.12 4.35,65.65 U6.13 | 11.86,47.04 11.78,46.96 11.78,45.88 11.56,45.65 11.56,45.52 10.59,45.52 U6.68 10.52,45.52 9.37,45.52 9.2,45.34 9.2,44.99 9.07,44.86 v9.07,43.99 | U6.61 | U6.61 4.14,47.65 4.29,47.8 v4.29,49.43 | U10.12 28.19,54.49 28.37,54.31 28.37,53.85 v28.52,53.7 | 11.9,63.55 11.9,63.89 12.01,64 12.01,65.08 11.74,65.35 U6.14 10.75,65.55 11.65,65.55 11.78,65.68 11.78,66.82 11.76,66.84 11.76,67.16 U6.8 | 11.9,63.55 11.9,63.43 12.01,63.31 v12.01,62.74 | U6.20 11.9,63.55 | U6.73 1.7,44.04 1.7,44.2 1.53,44.38 1.53,45.74 1.45,45.82 2.73,45.82 U6.67 | U6.195 1.53,7.45 v1.25,7.16
  Bottom 0.152: U7.8 20.1,31.94 19.99,32.06 U7.EP 20.24,32.94 U7.6 21.38,32.94 v22.07,33.63 | U5.6 18.59,21.01 | U5.3 18.59,21.01 | 18.59,21.01 U5.17 18.09,21.51 U5.14 U5.15 18.59,24.22 C8.1 | C4.1 3.73,48.62 4.39,49.28 5.61,49.28 U4.10 5.67,49.28 6.63,49.28 6.78,49.43 6.78,51 6.34,51.45 U4.12 | J8.6 5.76,59.02 v5.87,59.13 | U8.4 19.76,27.29 19.02,28.02 19.02,30.18 v18.72,30.48 | v4.14,42.16 4.51,42.64 4.51,43.44 4.64,43.58 5.17,43.58 U4.7 | 19.23,18.9 19.08,19.05 19.08,19.85 U5.5 | U3.2 16.66,27.38 17.35,27.38 17.45,27.28 17.55,27.28 17.81,27.02 18.04,27.02 19.25,25.81 v19.38,25.81 | J8.10 3.96,54.51 3.81,54.66 1.55,54.66 v1.19,55.02 | J5.P$1 2.72,51.26 v1.55,51.26 | v6.48,66.9 6.06,66.9 4.92,68.05 4.22,68.05 4.09,68.17 4.14,68.22 v4.14,70.16 | J14.7 11.1,4.93 v11.71,4.32 11.3,3.91 8.86,3.91 8.1,4.68 J14.4 | J14.1 4.22,5.13 v3.94,5.13 | J13.1 8.45,12.24 9.17,12.95 9.17,15.75 v9.02,15.9
  other vias: 28.83,31.75 22.83,19.1 6.98,61.37 16.13,73.76 16.08,23.22 13.49,7.52 13.74,24.49 15.47,37.39 9.07,65.18 15.06,58.52 5.41,65.43 26.9,20.17 19.58,46.28 29.13,37.03 31.52,55.83 18.47,36.58 14.76,34.49 20.75,40.49 21.21,35.81 16.28,56.34 15.98,66.34 4.34,7.32 12.01,12.75
  pour Top (rank 2): 0.38,75.03 38.53,75.39 38.73,0.05 0.38,0
  pour Bottom (rank 2): 0.43,75.08 38.63,75.34 38.73,0 0.43,-0.05
  pour Route2: 0.03,75.44 38.68,75.44 38.68,0.05 0.03,0.05
GPCLK1  (via drill 0.3)
  Top 0.152: U6.82 9.32,41.35 v9.17,41.2 | v12.32,33.73 12.41,33.65 12.41,26.74 14.3,24.85 14.3,23.27 v19.63,17.93 | v24.71,11.28 24.71,11.43 25.17,11.89 v25.17,15.95
  Bottom 0.152: v9.17,41.2 11.25,41.2 14.93,37.52 14.93,35.48 13.92,34.47 13.16,34.47 12.43,33.73 v12.32,33.73 | J4.6 24.75,11.24 v24.71,11.28 23.69,12.3 R10.1 | v25.17,15.95 22.02,15.95 21.05,16.92 20.65,16.92 v19.63,17.93
I2C_MPU_SCL  (via drill 0.3, 0.35)
  Top 0.152: U9.3 26.7,24.59 26.49,24.79 26.49,24.87 25.17,26.19 25.17,29.26 24.56,29.87 v24.56,32 | v27.2,53.34 28.78,51.77 30.35,51.77 30.91,51.21 30.91,48.26 30.25,47.6 26.67,47.6 v25.57,46.49 | v21.97,58.52 21.88,58.61 U10.61
  Bottom 0.152: v24.56,32 24.82,32.26 24.82,37.06 25.83,38.07 25.83,45.82 25.57,46.09 v25.57,46.49 | v27.2,53.34 22.02,58.52 v21.97,58.52
I2C_MPU_SDA  (via drill 0.3, 0.35)
  Top 0.152: U9.2 27.03,24.08 27.03,24.76 25.48,26.31 25.48,29.39 24.87,30 24.87,31.55 25.09,31.78 25.09,32.33 v25.48,32.72 | v27.71,54.05 27.91,53.85 27.91,53.06 28.9,52.07 30.48,52.07 31.22,51.33 31.22,48.13 30.38,47.3 27.71,47.3 27,46.58 v26.44,46.58 | U10.62 21.63,58.11 21.75,57.99 23.32,57.99 v23.34,57.96
  Bottom 0.152: v25.48,32.72 25.48,32.97 25.12,33.33 25.12,36.93 26.14,37.95 26.14,46.28 v26.44,46.58 | v27.71,54.05 23.8,57.96 v23.34,57.96
I2C_SCL  (via drill 0.3, 0.35)
  Top 0.152: U6.11 4.19,66.24 v4.29,66.35 | v3.93,57.15 5.05,57.15 5.07,57.17 7.17,57.17 9.15,55.19 9.86,55.19 v10.18,55.02
  Bottom 0.152: U8.3 20.75,26.92 20.6,26.77 19.84,26.77 18.72,27.89 18.72,28.96 17.09,30.58 15.21,30.58 14.5,31.29 14.5,33.53 14.93,33.96 14.98,33.96 15.29,34.27 15.29,34.32 16.5,35.53 16.5,42.64 16.74,42.88 17.57,42.88 U4.19 18.49,42.95 19.08,43.54 19.08,44.4 18.77,44.7 17.4,44.7 15.84,46.26 | v3.93,57.15 3.07,57.15 1.35,58.87 1.35,65.92 1.64,66.21 4.18,66.21 4.18,66.23 v4.29,66.35 | v10.18,55.02 10.18,54.51 10.08,54.41 10.08,53.75 13.09,50.75 14.91,50.75 16.03,49.63 16.03,48.92 15.47,48.36 15.47,46.63 15.84,46.26 | 15.84,46.26
I2C_SCL_1V8  (via drill 0.3, 0.35)
  Top 0.152: U9.6 26.3,22.45 26.56,22.19 | 26.56,22.19 28.05,22.19 v28.52,22.66 | 26.56,22.19 26.33,22.19 25.98,21.84 25.98,19.41 26.9,18.49 26.9,16.74 v26.98,16.66 | v28.12,15.49 28.12,13.06 v27.3,12.24
  Bottom 0.152: v28.52,22.66 28.52,23.5 28.42,23.6 28.42,24.06 28.52,24.15 28.52,27.06 28.38,27.2 28.38,28.07 29,28.69 31.1,28.69 | v26.98,16.66 26.98,16.64 v28.12,15.49 | v27.3,12.24 J4.7
I2C_SCL_5V  (via drill 0.3, 0.35)
  Top 0.152: v20.95,30.23 21.87,30.23 22.99,31.34 22.99,32.16 25.12,34.29 30.25,34.29 30.71,34.75 v31.32,34.75 31.32,34.8 | 31.32,34.8 31.32,39.88 v31.88,40.44 31.88,45.36 v32.08,45.57 | v33.15,31.5 33.15,32.97 31.32,34.8
  Bottom 0.152: U8.6 20.35,29.62 v20.95,30.23 | v31.32,34.75 31.33,34.76 J7.2 | v31.88,40.44 J2.2 | v32.08,45.57 32.08,45.27 J1.2 | J10.2 32.08,31.75 32.92,30.91 | J11.2 33.25,28.7 33.5,28.96 33.5,29.3 33.51,29.31 33.51,30.32 32.92,30.91 | 32.92,30.91 32.92,31.27 v33.15,31.5
I2C_SDA  (via drill 0.3, 0.35)
  Top 0.152: 1.86,66.85 U6.9 4.04,66.85 v4.7,67.51 | 15.98,43.94 15.93,43.89 v15.88,43.94 15.14,43.94 14.93,43.73 14.88,43.73 14.4,43.25 14.4,42.96 14.22,42.78 | v3.18,56.61 4.94,56.61 5.2,56.87 7.05,56.87 8.41,55.51 8.41,55.09 8.85,54.65 9.29,54.65 v9.48,54.46 | 14.22,42.78 | 14.22,42.78 14.08,42.64 14.08,40.11 14.21,39.98 14.21,39.96 14.3,39.88 14.3,36.13 13.76,35.59 13.41,35.59 13.08,35.26 13.08,34.24 v13.39,33.93
  Bottom 0.152: U4.18 17.53,43.94 v15.88,43.94 14.86,44.96 14.3,44.96 11.81,47.45 11.81,51.59 9.53,53.88 v9.48,54.46 | v4.7,67.51 2.52,67.51 1.04,66.04 1.04,58.74 v3.18,56.61 | U8.2 21.15,27.08 21.09,27.02 21.09,26.83 20.65,26.39 19.76,26.39 18.41,27.74 18.41,28.7 16.94,30.18 15.16,30.18 15.16,30.2 13.8,31.57 13.8,33.53 v13.39,33.93
I2C_SDA_1V8  (via drill 0.3)
  Top 0.152: U9.7 26.7,22.76 26.9,22.56 27.64,22.56 28.29,23.21 28.76,23.21 28.78,23.19 29.26,23.19 29.9,22.56 29.9,19.71 27.51,17.32 27.51,13.56 v27.2,13.26
  Bottom 0.152: v27.2,13.26 26.08,13.26 J4.8
I2C_SDA_5V  (via drill 0.3, 0.35)
  Top 0.152: v21.56,29.41 22.58,29.41 23.29,30.12 23.29,32.03 25.24,33.98 30.23,33.98 30.48,33.73 v31.32,33.73
  Bottom 0.152: U8.7 20.75,28.6 v21.56,29.41 | v31.32,33.73 31.34,33.76 32.28,33.76 | J7.1 32.28,33.76 | J7.1 32.56,33.83 33.45,33.83 33.66,34.04 33.66,37.67 | J2.1 33.66,37.67 | 33.66,37.67 33.66,42.7 J1.1 | 32.28,33.76 33.82,32.22 33.82,28.02 33.5,27.7 J11.1 | J10.1 31.48,32.75 J7.1
ID_SD  (via drill 0.35)
  Top 0.152: U6.15 4.21,65.05 4.21,65.07 5.68,66.54 5.68,67.02 7.7,69.04 v7.7,69.7
  Bottom 0.152: U11.CH_PD 36.55,62.79 34.98,62.79 30,67.77 16.08,67.77 15.52,68.33 12.09,68.33 11.71,68.71 11.71,68.93 11.1,69.55 10.95,69.55 10.49,70 10.48,70 10.17,70.31 9.75,70.31 9.14,70.92 8.66,70.92 7.7,69.95 v7.7,69.7
INT_A  (via drill 0.35)
  Top 0.152: v9.05,47.82 9.33,47.54 9.33,47.08 9.66,46.75 U6.64 | v14.72,44.31 15.18,44.31 15.72,44.86 19.63,44.86 20.09,44.4 20.14,44.4 22.29,42.25 | v27.66,38.4 27.66,40.29 27.3,40.64 25.68,40.64 24.21,42.11 22.43,42.11 22.29,42.25 | 22.29,42.25
  Bottom 0.152: v14.72,44.31 14.38,44.65 14.17,44.65 11.01,47.82 v9.05,47.82 | J10.3 29.98,30.75 29.38,31.36 29.38,31.68 29.36,31.7 29.36,35.84 28.87,36.33 27.66,37.54 v27.66,38.4
INT_B  (via drill 0.35)
  Top 0.152: U6.66 9.34,46.15 9.32,46.13 v8.81,46.63 | v15.11,43.18 15.86,43.18 16.41,43.72 16.41,43.97 16.99,44.55 19.51,44.55 19.97,44.09 20.02,44.09 22.16,41.95 v22.16,41.59
  Bottom 0.152: v8.81,46.63 11.28,46.63 12.57,45.34 12.57,45.32 13.89,43.99 14.25,43.99 14.49,43.76 14.54,43.76 v15.11,43.18 | J11.3 29.43,29.7 28.85,30.28 25.32,30.28 23.85,31.75 23.85,35.84 23.55,36.14 23.55,36.6 23.85,36.91 23.85,38.15 25.17,39.47 25.17,40.79 24.05,41.91 22.48,41.91 v22.16,41.59
MOTOR1  (via drill 0.35)
  Top 0.152: v29.64,42.37 29.64,43.13 30.86,44.35 30.86,45.72 36.35,51.21 36.35,57.05 32.74,60.66 32.24,60.66 U10.24 | v26.8,39.83 24.21,39.83 JP2.1
  Bottom 0.152: v29.64,42.37 29.01,41.73 29.01,40.41 28.43,39.83 v26.8,39.83
MOTOR2  (via drill 0.35)
  Top 0.152: v36.14,24.23 36.65,24.74 36.65,57.25 32.79,61.11 U10.25
  Bottom 0.152: v36.14,24.23 36.14,24.19 J12.1
MOTOR3  (via drill 0.35)
  Top 0.152: v36.6,22.61 36.96,22.96 36.96,57.46 32.79,61.62 U10.26
  Bottom 0.152: v36.6,22.61 35.56,22.61 J12.2
MOTOR4  (via drill 0.35)
  Top 0.152: v36.65,21.54 37.26,22.15 37.26,57.66 32.79,62.13 32.21,62.13 U10.27
  Bottom 0.152: v36.65,21.54 35.53,21.54 J12.3
N$1
  Bottom 0.152: L1.P$1 3.54,49.54 4.45,50.44 | 4.45,50.44 5.54,50.44 U4.11 | J5.P$3 4.45,51.66 4.45,51.5 4.47,51.48 4.47,51.04 4.45,51.01 4.45,50.44
N$2
  Bottom 0.152: C6.2 17.69,18.48 18.11,18.9 18.11,19.84 U5.7
N$3
  Bottom 0.152: C6.1 16.53,18.95 17.3,18.95 17.55,19.2 17.55,19.82 U5.8
N$4
  Bottom 0.152: R32.1 18.02,14.17 18.77,14.17 18.94,14.34 D1.A
N$5  (via drill 0.3)
  Top 0.152: R1.2 14.91,24.23 | 15.11,24.29 R1.2 | v15.52,25.65 15.18,25.31 R1.2
  Bottom 0.152: U5.13 17.59,25.11 17.04,25.65 v15.52,25.65 15.52,27.39 14.9,28 14.45,28 U3.6 | 13.96,28.5 U3.6 | U3.6 14.77,28.44
N$6  (via drill 0.3, 0.35)
  Top 0.152: v18.52,32.06 17.2,32.06 14.19,29.05 | R2.2 13.23,30 14.19,29.05 | v14.15,25.76 14.19,25.8 14.19,29.05
  Bottom 0.152: U7.2 18.9,32.44 v18.52,32.06 | U3.5 14.71,27.48 15.06,27.13 15.06,26.16 14.66,25.76 v14.15,25.76
N$7  (via drill 0.3)
  Top 0.152: R3.1 29.55,48.62 v30.15,48.62
  Bottom 0.152: U11.CS0 33.05,50.69 33.05,49.78 32.38,49.12 30.66,49.12 v30.15,48.62
N$8  (via drill 0.3)
  Top 0.152: R5.1 29.6,50.95 v30.35,50.95
  Bottom 0.152: U11.MISO 30.59,50.72 v30.35,50.95
N$9  (via drill 0.35)
  Top 0.152: R6.1 28.07,49.53 v28.37,49.84
  Bottom 0.152: v28.37,49.84 28.37,50.01 U11.GPIO9
N$10  (via drill 0.35)
  Top 0.152: R7.1 v26.95,52.12
  Bottom 0.152: v26.95,52.12 26.95,50.83 U11.GPIO10
N$11
  Top 0.254: U10.30 C5.2
N$12
  Bottom 0.152: U2.2 13.4,69.89 13.64,69.65 15.57,69.65 15.88,69.95 16.62,69.95 C15.2
N$13
  Bottom 0.152: R12.1 3.96,44.63 5.16,45.82 6.43,45.82 7.29,46.69 7.29,47.55 6.73,48.11 5.68,48.11 U4.9
N$14  (via drill 0.35)
  Top 0.152: R8.1 v24.31,50.75
  Bottom 0.152: v24.31,50.75 25.03,50.75 U11.MOSI
N$15  (via drill 0.35)
  Top 0.152: R9.1 21.26,53.14 v22.33,52.07
  Bottom 0.152: v22.33,52.07 22.33,51.45 U11.SCLK
N$16
  Top 0.152: U10.60 18.62,59.11 18.59,59.08 17.91,59.08 R14.2
N$17
  cutout Top: 9.93,27.99 3.33,27.99 3.33,7.16 9.93,7.16
N$18
  cutout Bottom: 0.99,21.03 0.99,8.89 4.65,5.23 13.39,5.23 15.93,7.77 20.24,7.77 21.21,6.81 25.48,6.81 26.64,7.98 26.64,11.68 25.58,12.75 22.53,12.75 21.77,13.51 7.75,13.51 6.78,14.48 6.78,21.69 6.12,22.35 2.31,22.35
N$26
  Bottom 0.152: R12.2 2.15,44.96 C4.2 3.06,46.55 2.41,47.19 2.41,48.41 L1.P$2
N$29
  Bottom 0.152: C7.2 16.81,20.39 U5.9
N$30
  Bottom 0.152: 21.75,20.13 L2.P$1 | U5.1 U5.2
  Bottom 0.254: U5.2 20.38,21.51 21.75,20.13
N$32
  Bottom 0.152: U7.1 19.29,31.91 18.41,31.04 16.28,31.04 15.67,31.65 15.67,32.33 L3.P$1
N$48
  Bottom 0.152: U7.5 20.69,33.52 C18.1
N$53
  Top 0.152: R45.1 12.17,15.8 11.91,15.55 U6.168
NRST  (via drill 0.3)
  Top 0.152: U6.63 3.98,47.05 3.99,47.04 5.41,48.46 5.41,51.56 5.99,52.15 5.99,55.4 v5.67,55.72 | v12.78,62.38 20.9,54.25 21.88,54.25 22.13,54 25.32,54 25.69,54.37 U10.7
  Bottom 0.152: v5.67,55.72 6.12,56.18 6.79,56.18 6.83,56.13 7.29,56.13 8.56,57.4 10.47,57.4 11.07,58.01 11.07,60.63 12.2,61.76 12.78,62.33 v12.78,62.38
POWER_SEQ_EN  (via drill 0.35)
  Top 0.152: R4.2 17.34,26.94 v17.8,26.47
  Bottom 0.152: v17.8,26.47 16.62,26.47 U3.3
SCL0  (via drill 0.3, 0.35)
  Top 0.152: v5.66,33.68 5.61,34.8 6.12,35.31 6.12,44.22 6.93,45.03 6.93,50.52 7.52,51.11 7.52,52.29 8.05,52.82 v8.05,52.93 | v12.68,60.62 10.62,60.62 U6.30 | R11.1 13.45,56.63 v13.04,56.22
  Bottom 0.152: J13.13 6.07,24.24 5,25.3 5,32.01 5.74,32.75 5.74,33.19 5.66,33.27 v5.66,33.68 4.3,33.68 3.81,33.19 3.81,32.35 R16.2 | 12.51,56.25 12.76,56.5 | 12.51,56.25 12.14,55.88 9.65,55.88 8.59,54.81 8.59,53.47 v8.05,52.93 | 13.04,56.78 12.76,56.5 | 13.04,56.78 13.25,56.98 13.25,60.04 v12.68,60.62 | 12.76,56.5 v13.04,56.22 | v13.04,56.22 12.54,56.22 12.51,56.25 | v13.04,56.22 13.04,56.78
SCL1  (via drill 0.3)
  Top 0.152: v3.89,56.08 4.1,56.29 5.05,56.29 5.32,56.56 6.92,56.56 8.1,55.38 8.1,54.97 8.89,54.18 8.89,54.09 8.91,54.07 8.91,52.61 8.13,51.82 8.13,50.16 8.91,49.38 8.91,48.64 8.46,48.19 8.46,48.18 8,47.73 8,43.71 8.43,43.27 8.43,41.38 8.46,41.35 8,40.9 8,32.89 8.89,32 8.89,31.12 8.82,31.05 v8.82,30.13 | v2.11,56.54 1.19,57.46 1.19,62 1.53,62.33 1.53,67.85 1.73,68.05 U6.5 | R18.2 18.92,7.32 18.23,6.63 18.19,6.63 18.16,6.6 18.14,6.63 17.63,6.63 v17.04,7.21 17.04,7.37 15.45,8.97 15.45,9.13 15,9.58 15,12.2 v13.28,13.92
  Bottom 0.152: 12.57,26.42 | 12.57,26.42 12.57,26.67 8.97,30.28 v8.82,30.13 | 12.57,26.42 12.57,17.27 12.78,17.07 12.78,15.42 13.28,14.91 v13.28,13.92 | v3.89,56.08 2.57,56.08 v2.11,56.54 | v17.04,7.21 17.1,7.16 J14.13
SD_CLK  (via drill 0.3)
  Top 0.152: R9.2 17.2,53.14 13.01,48.95 | 12.17,39.32 v12.07,39.22 12.07,40.16 12.17,40.26 12.17,43.31 12.57,43.71 12.57,47.48 12.55,47.51 12.55,48.2 12.62,48.28 12.62,48.57 13.01,48.95 | v1.3,43.49 2.72,43.49 U6.75 | 13.01,48.95
  Bottom 0.152: v12.07,39.22 12.07,39.17 9.52,36.63 4.84,36.63 4.51,36.95 4.51,40.73 3.38,41.86 2.92,41.86 v1.3,43.49
SD_CMD  (via drill 0.3)
  Top 0.152: 12.6,38.6 v12.46,38.47 12.46,38.86 12.6,39 12.6,39.44 12.47,39.57 12.47,43.18 12.88,43.59 12.88,47.61 12.85,47.63 12.85,48.07 13.16,48.39 13.82,48.39 14.1,48.67 21.79,48.67 21.96,48.84 25.86,48.84 26.03,48.67 R3.2 | v1.25,42.67 1.45,42.67 1.6,42.82 2.73,42.82 U6.77
  Bottom 0.152: v12.46,38.47 11.79,38.47 9.65,36.32 4.71,36.32 4.2,36.83 4.2,39.71 v1.25,42.67
SD_D0  (via drill 0.3)
  Top 0.152: R5.2 25.27,51.05 24.97,51.36 21.97,51.36 21.67,51.66 16.43,51.66 14.25,49.48 v14.25,49.28 | U6.81 1.4,41.65 v1.25,41.81 | v12.42,37.64 12.42,37.67 13,38.24 13,39.47 12.78,39.69 12.78,43.06 13.18,43.46 13.18,44.09 13.18,47.24 13.39,47.45 v13.39,47.85
  Bottom 0.152: v1.25,41.81 1.65,41.81 3.9,39.56 3.9,36.7 4.58,36.02 9.78,36.02 11.41,37.64 v12.42,37.64 | v13.39,47.85 13.39,48.41 v14.25,49.28
SD_D1  (via drill 0.3)
  Top 0.152: U6.83 1.24,41.05 v1.18,41 | v12.47,36.83 12.47,36.94 13.3,37.77 13.3,39.6 13.08,39.82 13.08,42.93 13.49,43.34 13.49,47.12 v14.5,48.13 | v15.27,49.48 16.48,50.7 19.11,50.7 R8.2
  Bottom 0.152: v1.18,41 2.01,41 3.6,39.41 3.6,36.57 4.46,35.71 9.91,35.71 11.02,36.83 v12.47,36.83 | v14.5,48.13 14.5,48.72 v15.27,49.48
SD_D2  (via drill 0.3)
  Top 0.152: U6.87 1.27,39.85 v1.25,39.83 | v13.39,36.98 13.39,37.42 13.61,37.64 13.61,39.73 13.47,39.86 13.47,42.89 13.79,43.21 13.79,46.99 14.4,47.6 14.93,47.6 14.93,47.78 15.27,48.11 v19.63,48.11 | v21.56,49.2 21.9,49.53 R6.2
  Bottom 0.152: v1.25,39.83 2.72,39.83 3.28,39.27 3.28,36.46 4.33,35.41 10.03,35.41 11,36.37 12.17,36.37 12.25,36.3 12.7,36.3 v13.39,36.98 | v19.63,48.11 20.73,49.2 v21.56,49.2
SD_D3  (via drill 0.3, 0.35)
  Top 0.152: U6.89 1.43,39.25 v1.19,39.01 | v13.54,36.12 13.54,36.17 14,36.63 14,39.73 13.91,39.81 13.91,39.85 13.78,39.98 13.78,42.76 14.1,43.08 14.1,43.34 | v12.48,49.17 12.62,49.17 17.4,53.95 21.76,53.95 R7.2 | v15.61,45.71 14.85,45.71 14.1,44.96 14.1,43.34 | 14.1,43.34
  Bottom 0.152: v1.19,39.01 2.57,39.01 2.97,38.61 2.97,36.34 4.2,35.1 10.16,35.1 11.02,35.97 13.39,35.97 v13.54,36.12 | v12.48,49.17 12.42,49.12 12.42,47.4 13.54,46.28 15.04,46.28 v15.61,45.71
SDA0  (via drill 0.3, 0.35)
  Top 0.152: v6.48,33.07 6.43,44.09 7.39,45.06 7.39,48.46 7.95,49.02 v8.05,49.02 | v13.59,60.55 12.99,61.15 U6.28 | R13.1 12.79,55.02 v12.47,55.02
  Bottom 0.152: J13.14 5.98,25.24 5.82,25.4 5.82,25.84 5.81,25.84 5.81,32.39 6.05,32.62 6.05,32.64 v6.48,33.07 6.48,33.68 5.92,34.24 2.83,34.24 R15.2 | v8.05,49.02 9.78,50.75 9.78,52.38 8.89,53.26 8.89,54.69 9.78,55.58 12.37,55.58 | v13.59,60.55 13.74,60.4 13.74,56.03 13.28,55.58 12.37,55.58 | v12.47,55.02 12.37,55.12 12.37,55.58
SDA1  (via drill 0.3)
  Top 0.152: U6.3 2.56,68.45 1.66,68.45 1.22,68.01 1.22,62.46 0.89,62.13 0.89,57.01 2.11,55.79 v2.11,55.68 | v3.58,55.26 3.93,55.26 4.65,55.98 5.17,55.98 5.45,56.26 6.79,56.26 7.72,55.33 7.72,54.83 8.61,53.95 8.61,52.78 8.59,52.76 8.59,52.71 7.82,51.95 7.82,50.03 8.61,49.25 8.61,48.77 8.15,48.32 8.15,48.31 7.7,47.85 7.7,43.58 8.13,43.15 8.13,41.45 7.67,41 7.67,32.74 8.15,32.26 8.15,31.55 v8.36,31.34 | v18.01,7.16 17.85,7.16 15.71,9.3 R17.2 15.44,10.48 15.44,12.43 13.84,14.02 v13.84,14.63
  Bottom 0.152: 12.88,26.29 12.88,17.4 13.08,17.19 13.08,15.54 13.77,14.86 13.77,14.71 v13.84,14.63 | 12.88,26.29 | 12.88,26.29 12.88,26.8 12.7,26.97 | 12.7,26.97 | 12.7,26.97 11.75,27.93 11.75,27.95 v8.36,31.34 | v2.11,55.68 3.17,55.68 v3.58,55.26 | v18.01,7.16 18.1,7.07 J14.14
SDX_CLK  (via drill 0.35)
  Top 0.152: v8.91,66.29 9.22,66.29 9.47,66.55 U6.10
  Bottom 0.152: J8.5 4.27,60.12 3.89,60.5 3.89,64.75 5.15,66.01 5.63,66.01 5.66,65.99 8.61,65.99 v8.91,66.29
SDX_CMD  (via drill 0.35)
  Top 0.152: U6.12 10.54,65.94 9.35,65.94 9.15,65.74 8.8,65.74 8.48,65.42 8.48,64.31 8.45,64.28 8.45,64.27 7.44,63.27 7.44,62.79 v7.34,62.69
  Bottom 0.152: J8.3 6.98,62.32 v7.34,62.69
SDX_D0  (via drill 0.35)
  Top 0.152: v7.64,58.52 7.64,61.98 7.9,62.23 7.9,63.3 9.25,64.64 9.29,64.64 9.4,64.75 U6.16
  Bottom 0.152: J8.7 5.81,57.92 6.17,57.56 6.68,57.56 v7.64,58.52
SDX_D1  (via drill 0.35)
  Top 0.152: U6.18 9.42,64.16 8.76,63.5 8.68,63.5 8.36,63.17 8.36,58.62 v8.66,58.32
  Bottom 0.152: J8.8 7.16,56.82 v8.66,58.32
SDX_D2  (via drill 0.35)
  Top 0.152: v8.91,62.94 U6.22
  Bottom 0.152: J8.1 6.17,64.52 6.94,63.75 8.1,63.75 v8.91,62.94
SDX_D3  (via drill 0.35)
  Top 0.152: v8.91,62.03 9.22,62.13 9.42,62.33 10.54,62.33 U6.24
  Bottom 0.152: J8.2 7.62,63.42 v8.91,62.03
SERVO1  (via drill 0.3, 0.35)
  Top 0.152: v15.42,41.15 16.48,40.03 18.47,40.03 19.69,38.81 19.84,38.81 21.66,36.98 22.78,36.98 23.14,37.34 24.79,37.34 v25.68,36.45 | U6.45 2.78,52.43 3.79,52.43 4.21,52.85 v5.46,52.85
  Top 0.178: JP1.1 28.07,29.01 v28.07,32.31
  Bottom 0.152: v15.42,41.15 14.3,41.1 10.52,44.88 10.44,44.88 10.41,44.91 9.55,44.91 8.05,46.41 8.05,48.01 8,48.06 8,48.18 7.44,48.74 7.44,51.7 7.37,51.78 7.37,51.84 6.45,52.76 5.55,52.76 v5.46,52.85
  Bottom 0.178: v28.07,32.31 27.16,33.21 26.86,33.21 26.72,33.35 26.72,35.63 26.16,36.18 25.95,36.18 v25.68,36.45
SERVO2  (via drill 0.3, 0.35)
  Top 0.152: v15.32,40.23 15.88,40.18 16.38,39.68 18.31,39.68 19.48,38.51 19.71,38.51 21.54,36.68 22.99,36.68 23.24,36.93 24.34,36.93 24.43,36.83 24.51,36.83 25.7,35.64 v25.93,35.64 | U6.47 4.58,51.85 4.84,52.11 v4.84,52.31
  Top 0.178: JP1.2 v26.9,32.56
  Bottom 0.152: v15.32,40.23 14.96,40.59 14.3,40.59 10.29,44.6 9.42,44.6 7.7,46.33 7.7,48.06 7.14,48.62 7.14,51.57 6.63,52.08 6.5,52.08 6.27,52.31 v4.84,52.31
  Bottom 0.178: v25.93,35.64 25.93,33.53 v26.9,32.56
SPI_CS0  (via drill 0.35)
  Top 0.152: U6.27 4.48,61.45 5.31,62.28 5.31,62.99 7.23,64.91 7.23,68.14 8.25,69.17 8.25,71.07 v10.85,73.66
  Bottom 0.152: v10.85,73.66 10.85,72.76 U2.5
SPI_CS1  (via drill 0.35)
  Top 0.152: v22.38,59.49 22.84,59.49 23.59,58.73 30.86,58.73 30.98,58.61 U10.20 | v14.86,61.52 13.58,62.8 13.31,62.8 v12.45,63.66 | v6.25,65.33 6.25,65.15 3.75,62.65 U6.23
  Bottom 0.152: v22.38,59.49 21.11,60.76 15.77,60.76 15.01,61.52 v14.86,61.52 | v12.45,63.66 12.2,63.91 9.38,63.91 8.01,65.28 6.3,65.28 v6.25,65.33
SPI_MISO  (via drill 0.3, 0.35)
  Top 0.152: v12.12,73.71 11.68,73.71 11.08,73.1 10.72,73.1 8.57,70.96 8.57,69.24 8.56,69.23 8.56,69.04 7.53,68.01 7.53,67.82 | U6.29 2.8,60.81 3.94,60.81 4.27,61.15 4.6,61.15 5.61,62.15 5.61,62.69 6.18,63.25 6.18,63.43 7.25,64.5 7.53,64.79 7.53,65.02 | U10.22 32.16,59.64 23.9,59.64 v22.33,61.21 | v15.77,62.23 13.79,64.22 v13.51,64.22 | v7.81,67.77 7.58,67.77 7.53,67.82 | 7.53,67.82 7.53,65.02 | 7.53,65.02
  Bottom 0.152: U2.6 12.15,73.68 v12.12,73.71 | v22.33,61.21 22.02,61.52 16.87,61.52 16.16,62.23 v15.77,62.23 | v13.51,64.22 13.21,64.52 11.68,64.52 10.69,65.51 10.69,66.65 9.58,67.77 v7.81,67.77
SPI_MOSI  (via drill 0.3, 0.35)
  Top 0.152: v13.39,73.71 13.08,73.71 12.32,72.95 11.35,72.95 11.2,72.8 10.86,72.8 8.88,70.82 8.88,68.93 8.44,68.49 | U6.33 3.99,59.64 5.92,61.57 5.92,62.48 6.48,63.05 6.48,63.3 7.87,64.69 7.87,66.47 8.08,66.67 8.08,67.18 8.12,67.23 8.12,67.29 8.37,67.54 8.37,68.42 8.44,68.49 | U10.23 24.7,60.11 v22.99,61.82 | v15.72,63.09 15.42,63.09 v13.44,65.08 | v8.63,68.32 8.46,68.49 8.44,68.49
  Bottom 0.152: U2.7 13.4,73.7 v13.39,73.71 | v22.99,61.82 16.99,61.82 v15.72,63.09 | v13.44,65.08 13.13,65.08 12.88,64.82 11.81,64.82 11,65.63 11,66.78 9.7,68.07 8.88,68.07 v8.63,68.32
SPI_SCLK  (via drill 0.3, 0.35)
  Top 0.152: v14.61,73.71 14.3,73.71 13.34,72.75 12.55,72.75 12.3,72.49 10.99,72.49 9.19,70.7 9.19,67.35 v9.03,67.2 8.32,66.48 8.32,65.69 8.18,65.55 8.18,64.44 7.64,63.91 6.79,63.04 6.79,62.84 6.22,62.28 6.22,61.32 3.99,59.08 2.79,59.08 U6.35 | U10.21 23.65,59.11 v22.4,60.36 | v14.81,62.38 14.52,62.38 v13.54,63.36
  Bottom 0.152: U2.8 14.65,73.66 v14.61,73.71 | v22.4,60.36 22.12,60.36 21.31,61.16 16.03,61.16 v14.81,62.38 | v13.54,63.36 12.69,64.21 11.56,64.21 10.39,65.38 10.39,65.84 v9.03,67.2
SWCLK  (via drill 0.3)
  Top 0.152: U6.69 3.82,45.25 5.71,47.14 5.71,51.36 6.3,51.94 6.3,55.41 6.53,55.64 v6.57,55.64 | v16.08,64.57 16.12,64.61 U10.49
  Bottom 0.152: v6.57,55.64 6.66,55.73 7.38,55.73 8.75,57.1 10.59,57.1 11.38,57.89 11.38,60.51 12.33,61.45 12.73,61.85 13,61.85 15.71,64.57 v16.08,64.57
SWDIO  (via drill 0.3)
  Top 0.152: U6.71 2.95,44.85 3.85,44.85 6.02,47.02 6.02,50.9 6.6,51.49 6.6,54.58 7.14,55.11 v7.19,55.11 | v23.75,65.58 23.75,66.55 U10.46
  Bottom 0.152: v7.19,55.11 8.87,56.79 10.74,56.79 11.68,57.73 11.68,60.38 12.45,61.15 12.46,61.15 12.85,61.54 13.16,61.54 15.37,63.75 16.95,63.75 17.09,63.61 18.43,63.61 18.57,63.75 21.92,63.75 v23.75,65.58
UART2_RX  (via drill 0.35)
  Top 0.152: U6.72 11.83,44.35 v11.93,44.25 | v15.21,42.01 19.13,42.01 v19.28,41.86 | v22.28,44.15 22.68,44.15 22.88,44.35 28.73,44.35 v29.19,43.89
  Bottom 0.152: v11.93,44.25 14.18,42.01 v15.21,42.01 | v19.28,41.86 19.99,41.86 v22.28,44.15 | v29.19,43.89 30.4,43.89 J9.2
UART2_TX  (via drill 0.35)
  Top 0.152: U6.70 11.85,44.95 v12.01,45.11 | v21.36,44.09 21.97,44.7 22.51,44.7 22.55,44.65 28.78,44.65 v29.03,44.91 | v19.23,42.72 19.07,42.56 v15.95,42.56
  Bottom 0.152: v12.01,45.11 12.68,44.45 12.68,43.94 14,42.62 15.89,42.62 v15.95,42.56 | v19.23,42.72 19.99,42.72 v21.36,44.09 | v29.03,44.91 30.38,44.91 J9.1
USART1_RX  (via drill 0.3, 0.35)
  Top 0.152: U6.53 1.53,50.05 v1.4,49.92 | v8.86,51.71 9.22,52.07 9.22,53.49 9.33,53.6 9.33,53.62 9.46,53.75 9.93,53.75 10.33,54.15 v10.69,54.15 | v18.36,59.64 18.4,59.61 U10.59 | v25.07,45.57 25.07,46.2 25.01,46.26 25.01,47.72 v25.58,48.29 | v25.07,42.42 25.07,42.32 26.44,40.95 28.93,40.95 29.49,40.39 v30.3,40.39
  Bottom 0.152: v1.4,49.92 1.17,50.14 1.14,50.14 1.01,50.28 1.01,54.22 1.14,54.36 3.68,54.36 4.18,53.86 4.18,53.84 4.42,53.59 6.17,53.59 8.05,51.71 v8.86,51.71 | v18.36,59.64 17.61,59.64 15.95,57.98 15.95,57.48 12.62,54.15 | v10.69,54.15 12.62,54.15 | 12.62,54.15 18.36,54.15 18.82,53.7 24.41,53.7 26.09,52.02 26.09,48.8 v25.58,48.29 | v25.07,45.57 v25.07,42.42 | J3.1 30.3,39.8 v30.3,40.39
USART1_TX  (via drill 0.35)
  Top 0.152: U6.51 2.56,50.45 1.18,50.45 0.84,50.11 0.84,43.78 0.65,43.59 0.65,38.7 v1.17,38.18 1.25,38.1 | v13.64,35.03 15.6,35.03 18.77,38.2 19.58,38.2 21.41,36.37 v24.1,36.37 | v25.12,38.41 25.38,38.41 25.93,37.85 28.27,37.85 v29.23,38.81
  Bottom 0.152: v1.17,38.18 2.41,36.93 2.41,36.07 3.68,34.8 10.29,34.8 10.69,35.2 13.46,35.2 v13.64,35.03 | v24.1,36.37 24.51,36.78 24.51,37.18 25.12,37.79 v25.12,38.41 | v29.23,38.81 30.4,38.81 J3.2
USB_D_N  (via drill 0.3)
  Top 0.229: U6.167 3.67,15.85 3.79,15.96 4.32,15.96 4.71,15.57 4.71,11.25 5.38,10.58 6.68,10.58 v7.04,10.29
  Bottom 0.229: v7.04,10.29 6.68,10.58 20.52,10.58 21.54,9.56 25.75,9.56 J4.4
USB_D_P  (via drill 0.3)
  Top 0.229: U6.165 3.68,16.45 3.79,16.35 4.47,16.35 5.09,15.73 5.09,11.41 5.54,10.96 6.68,10.96 v6.32,11.25
  Bottom 0.229: v6.32,11.25 6.68,10.96 20.68,10.96 21.69,9.94 25.77,9.94 J4.5

## Text on the board
tPlace: U9
bPlace: U11 | U2 | J8 | GND | 5V | Tele | U7 | U8 | S2 | S1 | M4-2 | -+ | J13 | POWER | J14 | J4
tNames: Central Board v4
bNames: 5V